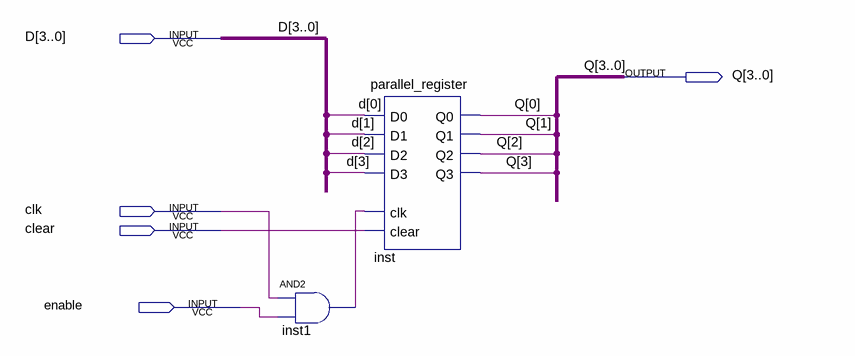
[diagram p0: schematic sheet]
// Quartus schematic parallel_register_bus.bdf as structural Verilog: 2 symbols, 5 pins
module parallel_register_bus (
  input  [3:0] D,
  input  clk,
  input  clear,
  input  enable,
  output [3:0] Q
);

  wire inst1_out;

  and inst1 (inst1_out, clk, enable);
  parallel_register inst (
    .D2(D[2]), .D3(D[3]), .D0(D[0]), .D1(D[1]), .clear(clear), .clk(inst1_out), .Q2(Q[2]), .Q3(Q[3]),
    .Q0(Q[0]), .Q1(Q[1]));
endmodule
